# Altium schematic sheet Sheet.SchDoc
size A4
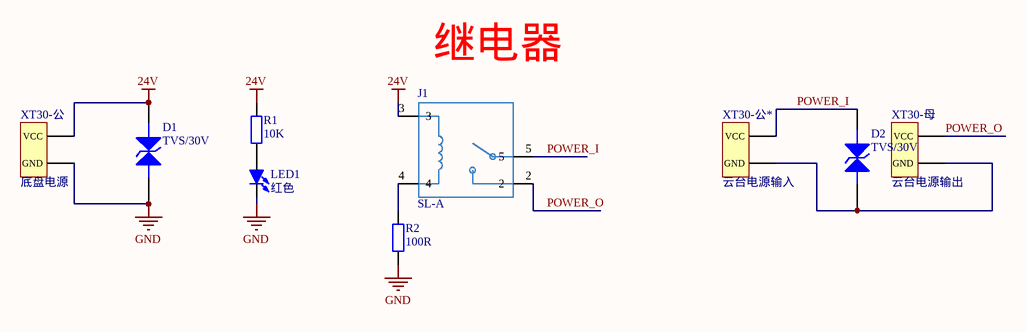
[diagram p0: Sheet.SchDoc]

## Parts
D1  TVS/30V  [SMB]
D2  TVS/30V  [SMB]
J1  SL-A  [RELAY-TH_SLA-XXVDC-SL-A]
LED1  红色  [LED 0603R]
R1  10K  [R 0603]
R2  100R  [R 0603]
XT30-公  底盘电源  [XT30-M]
XT30-公*  云台电源输入  [XT30-M]
XT30-母  云台电源输出  [XT30-M]

## Nets
24V: D1.2 J1.3 R1.2 XT30-公.1(VCC)
GND: D1.1 LED1.2(K) R2.1 XT30-公.2(GND)
POWER_I: D2.2 J1.5 XT30-公*.1(VCC)
POWER_O: J1.2 XT30-母.1(VCC)
NetD2_1: D2.1 XT30-公*.2(GND) XT30-母.2(GND)
NetJ1_4: J1.4 R2.2
NetLED1_1: LED1.1(A) R1.1

## Notes on the sheet
- (near J1) 继电器

## Library data of the parts
D1 D2 = TVS: TVS管
J1 = SLA-48VDC-SL-A
LED1 = LED-SMD: 贴片LED; 版权归属: 源创客; BOM名称: 贴片LED; 学习资源: www.ooocke.com
R1 R2 = R: 贴片电阻; 版权归属: 源创客; BOM名称: 贴片电阻; 学习资源: www.ooocke.com
XT30-公 XT30-公* XT30-母 = XT30